# EAGLE design LM1117-adj_power_supply (EAGLE 7.7.0)
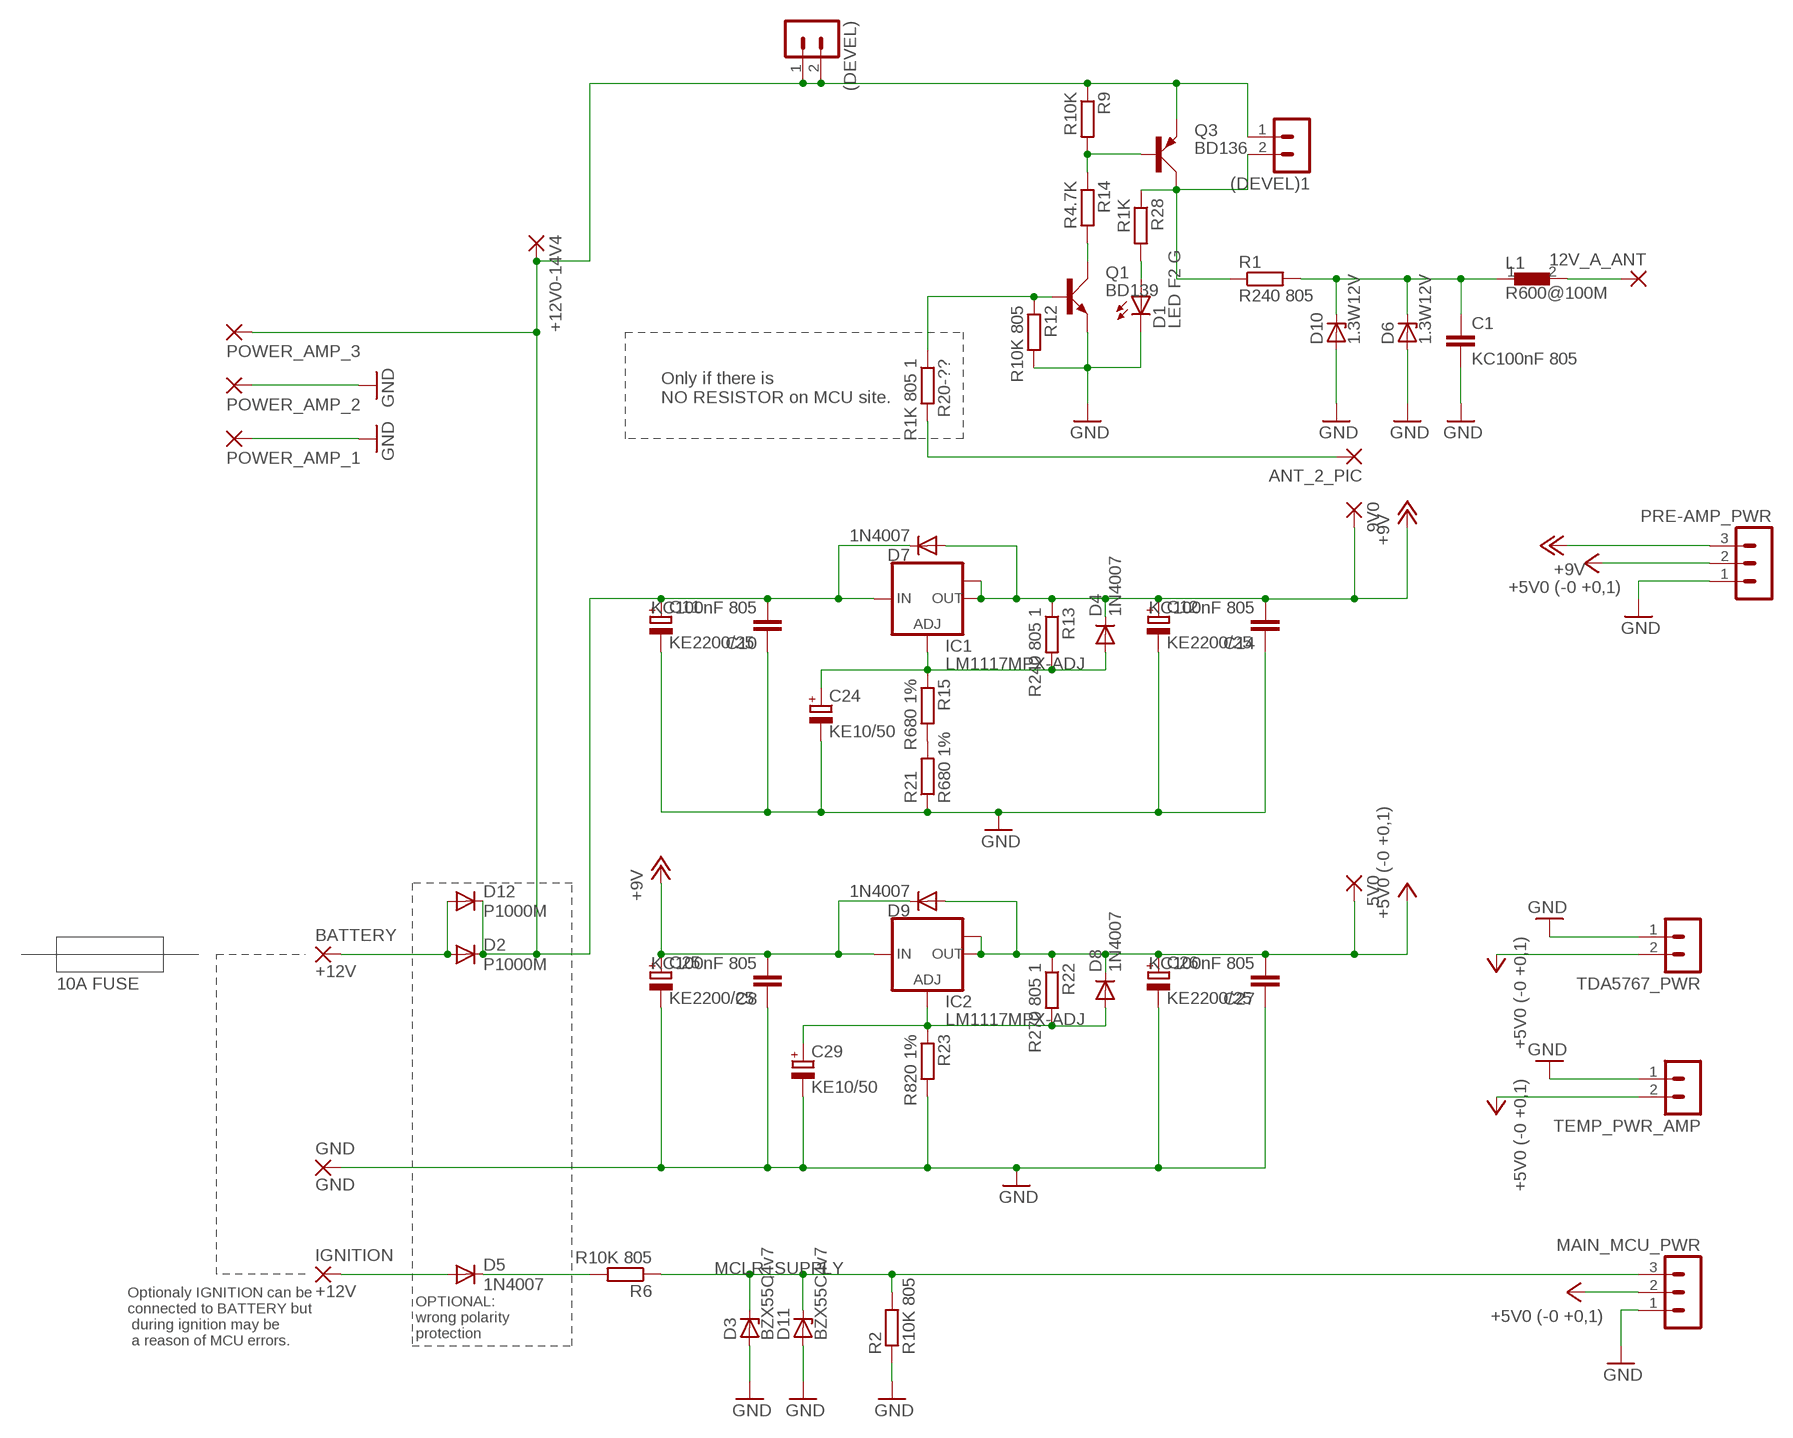
[diagram p0: schematic, sheet 1]

## Parts
5V0  3,17/1,3  [3,17/1,3]
9V0  3,17/1,3  [3,17/1,3]
12V_A_ANT  3,17/1,3  [3,17/1,3]
(DEVEL)  MA02-1  [MA02-1]
(DEVEL)1  MA02-1  [MA02-1]
+12V0-14V4  3,17/1,3  [3,17/1,3]
ANT_2_PIC  1,6/0,8  [1,6/0,8]
BATTERY  +12V  3,81/1,3  [3,81/1,3]
C1  KC100nF 805  C-EUC0805  [C0805]
C8  KC100nF 805  C-EUC0805  [C0805]
C10  KC100nF 805  C-EUC0805  [C0805]
C11  KE2200/25  CPOL-EUE5-13  [E5-13]
C12  KE2200/25  CPOL-EUE5-13  [E5-13]
C14  KC100nF 805  C-EUC0805  [C0805]
C24  KE10/50  CPOL-EUTT2D4  [TT2D4]
C25  KE2200/25  CPOL-EUE5-13  [E5-13]
C26  KE2200/25  CPOL-EUE5-13  [E5-13]
C27  KC100nF 805  C-EUC0805  [C0805]
C29  KE10/50  CPOL-EUTT2D4  [TT2D4]
D1  LED F2 G  SFH482  [SFH482]
D2  P1000M  GI820  [P6-15]
D3  BZX55C4v7  ZENER-DIODEZD-2.5  [ZDIO-2.5]
D4  1N4007  DIODE-D-2.5  [D-2.5]
D5  1N4007  DIODE-D-5  [D-5]
D6  1.3W12V  ZENER-DIODEZD-2.5  [ZDIO-2.5]
D7  1N4007  DIODE-D-5  [D-5]
D8  1N4007  DIODE-D-2.5  [D-2.5]
D9  1N4007  DIODE-D-5  [D-5]
D10  1.3W12V  ZENER-DIODEZD-2.5  [ZDIO-2.5]
D11  BZX55C4v7  ZENER-DIODEZD-2.5  [ZDIO-2.5]
D12  P1000M  GI820  [P6-15]
GND  GND  3,81/1,3  [3,81/1,3]
IC1  LM1117MPX-ADJ  [SOT223]
IC2  LM1117MPX-ADJ  [SOT223]
IGNITION  +12V  3,81/1,3  [3,81/1,3]
L1  R600@100M  FERRITR0805  [R0805]
MAIN_MCU_PWR  MA03-1  [MA03-1]
POWER_AMP_1  3,17/1,3  [3,17/1,3]
POWER_AMP_2  3,17/1,3  [3,17/1,3]
POWER_AMP_3  3,17/1,3  [3,17/1,3]
PRE-AMP_PWR  MA03-1  [MA03-1]
Q1  BD139  [TO126AV]
Q3  BD136  BD140  [TO126AV]
R1  R240 805  R-EU_M0805  [M0805]
R2  R10K 805  R-EU_R0805  [R0805]
R6  R10K 805  R-EU_R0805  [R0805]
R9  R10K  R-EU_0204/5  [0204/5]
R12  R10K 805  R-EU_R0805  [R0805]
R13  R240 805 1  R-EU_M0805  [M0805]
R14  R4.7K  R-EU_0204/5  [0204/5]
R15  R680 1%  R-EU_0204/2V  [0204V]
R20-??  R1K 805 1  R-EU_0204/2V  [0204V]
R21  R680 1%  R-EU_0204/2V  [0204V]
R22  R270 805 1  R-EU_M0805  [M0805]
R23  R820 1%  R-EU_0204/2V  [0204V]
R28  R1K  R-EU_0204/5  [0204/5]
TDA5767_PWR  MA02-1  [MA02-1]
TEMP_PWR_AMP  MA02-1  [MA02-1]

## Nets
+5V: 5V0.1(P) C26.+ C27.2 D8.C D9.A IC2.2(OUT) IC2.TAB(OUT1) MAIN_MCU_PWR.2 PRE-AMP_PWR.2 R22.1 TDA5767_PWR.2 TEMP_PWR_AMP.2 ; supply symbol labelled +5V0 (-0 +0,1)
+12V: 9V0.1(P) C8.2 C12.+ C14.2 C25.+ D4.C D7.A D9.C IC1.2(OUT) IC1.TAB(OUT1) IC2.3(IN) PRE-AMP_PWR.3 R13.1 ; supply symbol labelled +9V
+14.4V: (DEVEL)1.1 (DEVEL).1 (DEVEL).2 +12V0-14V4.1(P) C10.2 C11.+ D2.C D7.C D12.C IC1.3(IN) POWER_AMP_3.1(P) Q3.E R9.1
GND: C1.2 C8.1 C10.1 C11.- C12.- C14.1 C24.- C25.- C26.- C27.1 C29.- D1.K(C) D3.A D6.A D10.A D11.A GND.1(P) MAIN_MCU_PWR.1 POWER_AMP_1.1(P) POWER_AMP_2.1(P) PRE-AMP_PWR.1 Q1.E R2.1 R12.2 R21.1 R23.2 TDA5767_PWR.1 TEMP_PWR_AMP.1
MCLR_SUPPLY: D3.C D11.C MAIN_MCU_PWR.3 R2.2 R6.1
N$1: ANT_2_PIC.1(P) R20-??.2
N$2: C24.+ D4.A IC1.1(ADJ) R13.2 R15.1
N$3: R15.2 R21.2
N$6: BATTERY.1(P) D2.A D12.A
N$7: (DEVEL)1.2 Q3.C R1.1 R28.1
N$13: D5.A IGNITION.1(P)
N$14: D5.C R6.2
N$18: Q1.B R12.1 R20-??.1
N$19: Q1.C R14.2
N$25: Q3.B R9.2 R14.1
N$26: C1.1 D6.C D10.C L1.1 R1.2
N$27: C29.+ D8.A IC2.1(ADJ) R22.2 R23.1
N$33: 12V_A_ANT.1(P) L1.2
N$40: D1.A R28.2

## Notes on the sheet
- Only if there is
  NO RESISTOR on MCU site.
- 10A FUSE
- OPTIONAL:
  wrong polarity
  protection
- Optionaly IGNITION can be
  connected to BATTERY but
   during ignition may be
   a reason of MCU errors.

## Library data of the parts
5V0 9V0 12V_A_ANT +12V0-14V4 POWER_AMP_1-POWER_AMP_3 = wirepad:3,17/1,3: THROUGH-HOLE PAD
(DEVEL) (DEVEL)1 TDA5767_PWR TEMP_PWR_AMP = con-lstb_SileliS:MA02-1: PIN HEADER
ANT_2_PIC = wirepad:1,6/0,8: THROUGH-HOLE PAD
BATTERY GND IGNITION = wirepad:3,81/1,3: THROUGH-HOLE PAD
C1 C8 C10 C14 C27 = rcl:C-EU: CAPACITOR, European symbol
C11 C12 C24-C26 C29 = rcl:CPOL-EU: POLARIZED CAPACITOR, European symbol
D1 = led:SFH482: IR LED infrared emitting diode, Infineon
D2 D12 = diode:GI820: DIODE fast-recovery silicon diode, 6 A (Diotec)
D3 D6 D10 D11 = diode:ZENER-DIODE: Z-Diode
D4 D5 D7-D9 = diode:DIODE-: DIODE
IC1 IC2 = lm1117:LM1117MPX-ADJ
L1 = ferrit_bear:FERRIT
MAIN_MCU_PWR PRE-AMP_PWR = con-lstb_SileliS:MA03-1: PIN HEADER; OC_FARNELL: unknown; OC_NEWARK: unknown
Q1 = transistor-power:BD139: NPN TRANSISTOR
Q3 = transistor-power:BD140: PNP TRANSISTOR
R1 R2 R6 R9 R12-R15 R20-?? R21-R23 R28 = rcl:R-EU_: RESISTOR, European symbol

## Board
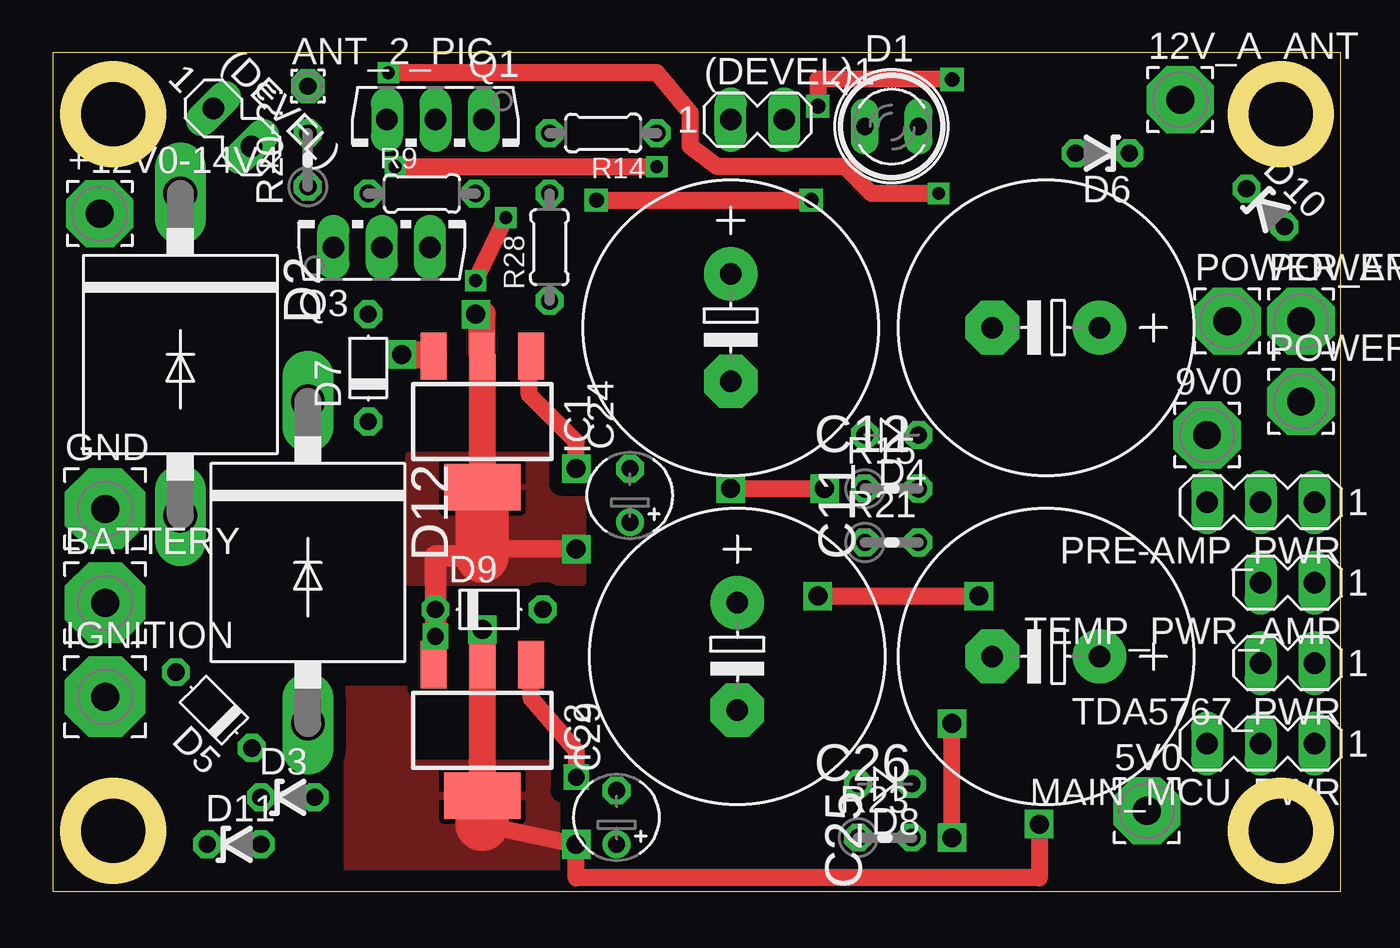
[diagram p1: board, top side]
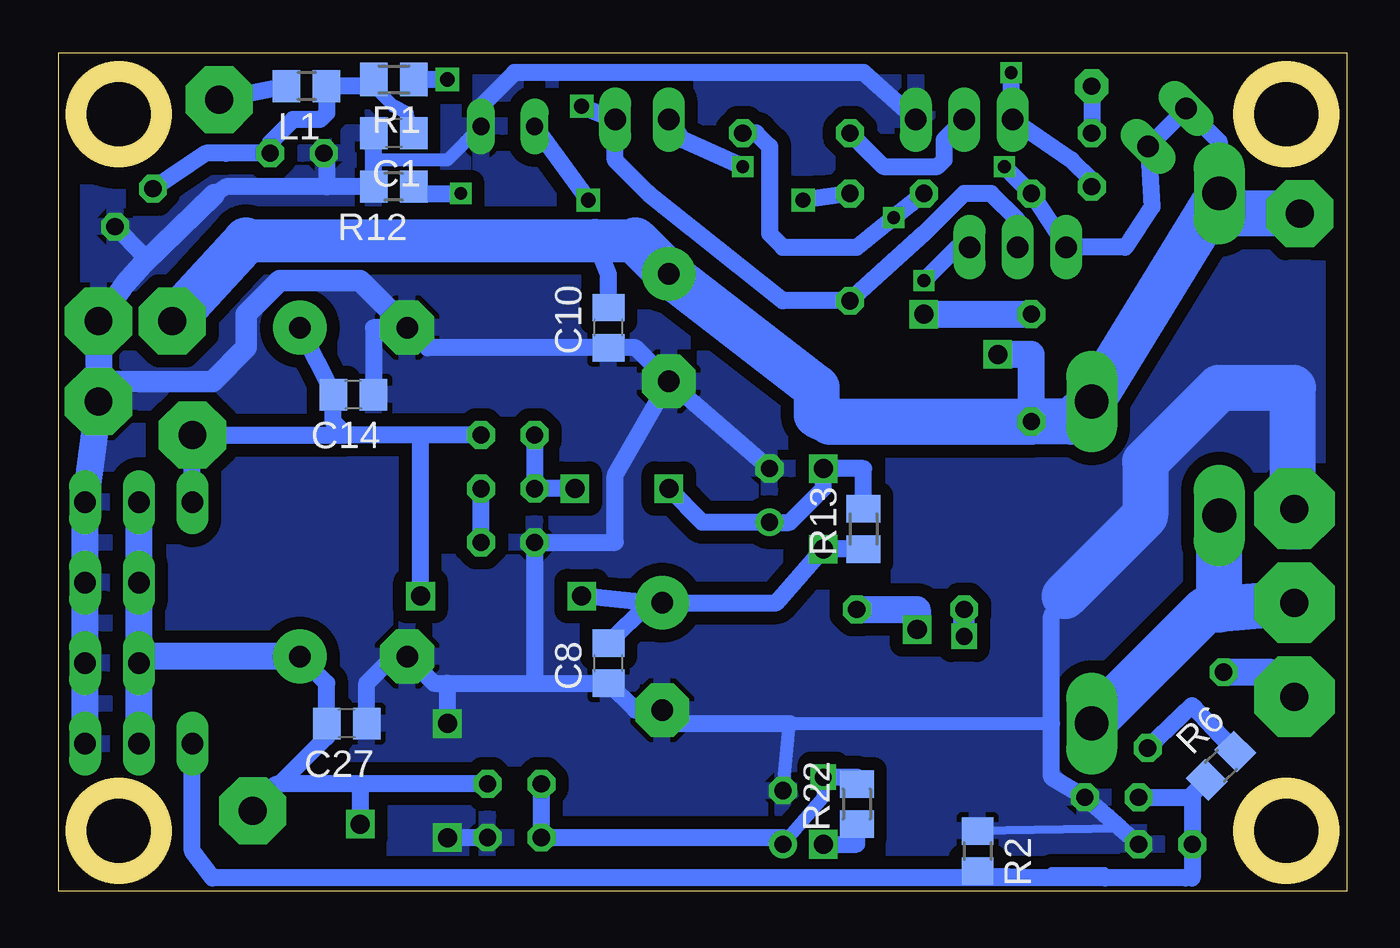
[diagram p2: board, bottom side, seen from below]

Size 60.94 x 39.67 mm. Coordinates in mm from the lower left corner, seen from the top.
Outline: 0,0 60.94,0 60.94,39.67 0,39.67 0,0
Outline: circle at 2.86,36.77 radius 2
Outline: circle at 58.1,2.86 radius 2
Outline: circle at 58.1,36.77 radius 2
Outline: circle at 2.86,2.86 radius 2
Copper layers (1*16): Top 0.035mm / dielectric 1.5mm / Bottom 0.035mm
Design rules "default": minimum track width 10mil, minimum drill 24mil, track to track 8mil, track to pad 8mil, pad to pad 8mil, via to via 8mil, smd to smd 8mil, copper to edge 40mil, drill to drill 8mil, minimum pad ring 10mil, minimum via ring 8mil, stop-mask expansion 4mil, vias tented up to drill 0mil, thermal gap 10mil

### Footprints (pad centres in the part's own frame; a part is rotated, then mirrored left to right if it is on the bottom)
3,17/1,3 = drill 1.321 pad 3.175 octagon: 1 0,0
MA02-1 = drill 1.016 long: 1 -2.54,0; 2 0,0
1,6/0,8 = drill 0.813 pad 1.6 octagon: 1 0,0
3,81/1,3 = drill 1.321 pad 3.81 octagon: 1 0,0
C0805 = smd 1.3 x 1.5: 1 -0.95,0; 2 0.95,0
E5-13 = drill 1.016 pad 2.54: + -2.54,0 | drill 1.016 pad 2.54 octagon: - 2.54,0
TT2D4 = drill 0.813: + -1.27,0 | drill 0.813 octagon: - 1.27,0
SFH482 = drill 0.813 long: A -1.27,0; K 1.27,0
P6-15 = drill 1.6 long: A 7.62,0; C -7.62,0
ZDIO-2.5 = drill 0.813 octagon: A 1.27,0; C -1.27,0
D-2.5 = drill 0.813 octagon: A 1.27,0; C -1.27,0
D-5 = drill 0.813 octagon: A 2.54,0; C -2.54,0
SOT223 = smd 1.219 x 2.235: 1 -2.311,-3.099; 2 0,-3.099; 3 2.311,-3.099 | smd 3.6 x 2.2: TAB 0,3.099
R0805 = smd 1.3 x 1.5: 1 -0.95,0; 2 0.95,0
MA03-1 = drill 1.016 long: 1 -2.54,0; 2 0,0; 3 2.54,0
TO126AV = drill 1.016 long: B 2.286,-1.27; C 0,-1.27; E -2.286,-1.27
M0805 = smd 1.3 x 1.6: 1 -0.95,0; 2 0.95,0
0204/5 = drill 0.813 octagon: 1 -2.54,0; 2 2.54,0
0204V = drill 0.813 octagon: 1 -1.27,0; 2 1.27,0

### Placement (x,y rotation side)
5V0  51.75,3.81 0 top
9V0  54.61,21.59 0 top
12V_A_ANT  53.34,37.47 0 top
(DEVEL)  9.39,35.24 315 top
(DEVEL)1  34.61,36.51 0 top
+12V0-14V4  2.22,32.07 0 top
ANT_2_PIC  12.06,38.1 0 top
BATTERY  2.48,13.65 0 top
C1  45.08,35.88 180 bottom
C8  34.92,10.8 90 bottom
C10  34.92,26.67 90 bottom
C11  32.07,26.67 270 top
C12  46.99,26.67 180 top
C14  46.99,23.5 180 bottom
C24  27.3,18.73 90 top
C25  32.38,11.11 270 top
C26  46.99,11.11 180 top
C27  47.31,7.94 180 bottom
C29  26.67,3.49 90 top
D1  39.69,36.2 0 top
D2  6.03,25.4 270 top
D3  11.11,4.44 0 top
D4  39.69,21.59 180 top
D5  7.62,8.57 135 top
D6  49.66,34.93 180 top
D7  14.92,24.77 90 top
D8  39.37,5.08 180 top
D9  20.64,13.34 0 top
D10  57.37,32.35 315 top
D11  8.57,2.22 0 top
D12  12.06,15.56 270 top
GND  2.48,18.1 0 top
IC1  20.32,22.23 180 top
IC2  20.32,7.62 180 top
IGNITION  2.48,9.21 0 top
L1  49.21,38.1 180 bottom
MAIN_MCU_PWR  57.15,6.99 180 top
POWER_AMP_1  59.06,23.18 0 top
POWER_AMP_2  59.06,26.99 0 top
POWER_AMP_3  55.56,26.99 0 top
PRE-AMP_PWR  57.15,18.41 180 top
Q1  18.1,35.24 180 top
Q3  15.56,31.75 0 top
R1  45.08,38.42 180 bottom
R2  17.46,1.91 270 bottom
R6  5.94,5.94 45 bottom
R9  17.46,33.02 0 top
R12  45.08,33.34 180 bottom
R13  22.86,17.14 90 bottom
R14  26.03,35.88 180 top
R15  39.69,19.05 0 top
R20-??  12.06,34.61 90 top
R21  39.69,16.51 0 top
R22  23.18,4.13 90 bottom
R23  39.37,2.54 0 top
R28  23.49,30.48 90 top
TDA5767_PWR  57.15,10.8 180 top
TEMP_PWR_AMP  57.15,14.61 180 top

### Tracks (layer width: path | path; a pad name or v marks a point on that pad's centre or on a via)
+5V  (via drill 0.9)
  Top 0.813: 20.32,3.17 v24.76,2.22 24.76,0.63 46.67,0.63 v46.67,3.17
  Top 1.27: v20.32,12.38 IC2.2 IC2.TAB
  Top 2.54: IC2.TAB 20.32,3.17
  Bottom 0.813: C26.+ 48.26,9.84 C27.2 48.26,7.3 50.96,4.6 | 50.96,4.6 5V0.1 | 46.67,5.08 50.48,5.08 arc-90 50.96,4.6 | v24.76,2.22 23.18,2.22 R22.1 | D8.C 46.67,5.08 | 46.67,5.08 v46.67,3.17
  Bottom 1.27: D9.A 20.32,13.34 v20.32,12.38 | PRE-AMP_PWR.2 TEMP_PWR_AMP.2 TDA5767_PWR.2 | TDA5767_PWR.2 MAIN_MCU_PWR.2 | C26.+ 56.83,11.11 arc-90 TDA5767_PWR.2
  pour Top (isolate 0.61): 23.81,6.03 23.81,0.63 13.97,0.63 13.97,9.53 16.83,9.53 16.83,6.03
+12V  (via drill 0.8, 0.9)
  Top 0.813: v24.76,16.19 20.64,16.19 20.32,15.88 | v36.19,13.97 v43.81,13.97
  Top 1.016: IC2.3 18.01,12.07 v18.1,12.07 18.1,15.88 20.32,15.88
  Top 1.27: v20,27.3 20.32,27.3 IC1.2 IC1.TAB
  Top 2.54: 20.32,15.88 IC1.TAB
  Bottom 0.813: R13.1 24.44,16.2 v24.76,16.19 26.99,13.65 C25.+ 33.02,13.65 | C8.2 33.02,13.65 | D4.C 43.81,21.59 | 43.81,21.59 47.31,21.59 | 47.31,21.59 47.94,22.23 C14.2 C12.+ | PRE-AMP_PWR.3 9V0.1 47.31,21.59 | 33.02,13.65 v36.19,13.97 | v43.81,13.97 43.81,21.59
  Bottom 1.016: D9.C v18.1,12.07
  Bottom 1.27: v20,27.3 D7.A
  pour Top (isolate 0.61): 16.83,20.64 25.08,20.64 25.08,14.61 16.83,14.61
+14.4V  (via drill 0.6, 0.9)
  Top 0.813: v16.19,34.29 v28.57,34.29
  Top 1.27: v16.51,25.4 17.93,25.4 arc-90 IC1.3
  Bottom 0.813: D2.C 6.03,35.47 (DEVEL).1 (DEVEL).2 9.21,32.38 10.48,30.48 Q3.E R9.1 v16.19,34.29 | C10.2 34.92,29.21 35.56,30.8 | v28.57,34.29 31.43,35.56 (DEVEL)1.1
  Bottom 1.27: D7.C 14.92,25.4 v16.51,25.4
  Bottom 2.032: 52.07,30.8 35.56,30.8 33.65,30.8
  Bottom 2.184: +12V0-14V4.1 6.03,32.07 D2.C D12.C 13.02,22.23 D7.C 24.45,22.23 25.08,22.54 25.08,23.81 31.67,28.9 C11.+ 33.65,30.8 | POWER_AMP_3.1 52.07,30.8
GND  (via drill 0.9)
  Top 0.813: v42.54,2.54 v42.54,7.94
  Bottom 0.406: R2.1 10.7,2.97
  Bottom 0.61: C29.- 26.35,7.94 13.97,7.94 | D1.K 42.54,34.61 46.03,34.61
  Bottom 0.813: 13.33,13.97 13.97,13.02 13.97,7.94 13.97,5.4 D3.A 10.7,2.97 D11.A | 26.35,7.94 31.75,7.94 C25.- 33.65,8.57 C8.1 38.42,9.84 | C24.- C11.- | C11.- 33.66,25.72 C10.1 43.5,25.72 C12.- 46.04,26.67 C14.1 | C27.1 46.36,9.84 45.08,11.11 C26.- 43.18,9.84 42.54,9.84 | 42.54,9.84 38.42,9.84 | 38.42,9.84 R21.1 34.61,16.51 34.61,19.69 C11.- | C1.2 46.03,34.61 R12.2 48.26,33.34 | 48.26,33.34 53.02,33.34 53.59,32.95 | Q1.E 22.86,38.73 39.37,38.73 40.96,37.15 D1.K | R23.2 v42.54,2.54 | v42.54,7.94 42.54,9.84 | D6.A 48.26,34.79 48.26,33.34 | D10.A 56.95,30.13 56.95,29.67
  Bottom 1.016: C12.- 46.67,28.89 50.48,28.89 52.07,27.3 52.07,25.72 53.66,24.13 59.06,24.13 | 53.59,32.95 56.95,29.67 57.78,28.76 POWER_AMP_2.1
  Bottom 1.27: POWER_AMP_2.1 59.06,24.13 POWER_AMP_1.1 PRE-AMP_PWR.1 TEMP_PWR_AMP.1 TDA5767_PWR.1 MAIN_MCU_PWR.1
  Bottom 2.184: GND.1 2.54,18.16 2.54,23.81 6.03,23.81 9.52,20.32 9.52,17.78 13.33,13.97
  pour Bottom (isolate 0.61): -1.27,40.01 62.23,40.01 62.23,-0.64 -2.22,-1.27
MCLR_SUPPLY
  Bottom 0.406: 13.97,0.96 11.43,0.96 11.43,0.63 | R2.2 7.62,0.63
  Bottom 0.813: MAIN_MCU_PWR.3 54.61,1.91 53.66,0.63 11.43,0.63 7.62,0.63 7.3,0.63 D11.C 7.3,4.44 | R6.1 7.3,4.58 7.3,4.44 | D3.C 7.3,4.44
N$1
  Bottom 0.813: ANT_2_PIC.1 R20-??.2
N$2  (via drill 0.9)
  Top 0.813: v24.76,20 24.76,21.27 22.54,23.5 22.54,25.24 IC1.1 | v32.07,19.05 v36.51,19.05
  Bottom 0.813: R13.2 22.86,20 v24.76,20 24.76,19.05 26.35,17.46 C24.+ 30.48,17.46 v32.07,19.05 | D4.A R15.1 v36.51,19.05
N$3
  Bottom 0.813: R21.2 R15.2
N$6
  Bottom 2.184: D2.A 6.03,13.34 BATTERY.1 6.67,13.34 D12.A
N$7  (via drill 0.7)
  Top 0.813: v42.54,38.42 36.19,38.42 v36.19,37.15
  Bottom 0.813: Q3.C 15.56,31.75 16.83,33.02 18.1,33.02 20,31.12 R28.1 26.67,27.94 33.02,33.02 34.61,34.61 (DEVEL)1.2 v36.19,37.15 | R1.1 v42.54,38.42
N$13
  Bottom 1.27: IGNITION.1 3.64,10.37 D5.A
N$14
  Bottom 0.813: D5.C 7.3,8.79 R6.2
N$18  (via drill 0.6)
  Top 0.813: v41.91,33.02 38.73,33.02 37.46,34.29 31.43,34.29 30.16,35.24 30.16,36.83 28.57,38.73 v15.88,38.73
  Bottom 0.813: R20-??.1 12.06,33.66 13.02,34.61 Q1.B 15.88,36.58 v15.88,38.73 | R12.1 43.82,33.02 v41.91,33.02
N$19
  Bottom 0.813: Q1.C 19.05,35.56 19.05,34.61 19.37,34.29 21.91,34.29 R14.2
N$25  (via drill 0.6)
  Top 0.813: v20,28.89 v21.43,31.87
  Bottom 0.813: R14.1 27.94,35.88 27.3,35.24 27.3,31.12 26.67,30.48 23.18,30.48 v21.43,31.87 R9.2 | Q3.B 18.41,30.48 v20,28.89
N$26
  Bottom 0.61: C1.1 44.45,36.83 45.08,37.15 46.03,38.1
  Bottom 0.813: 46.03,38.1 R1.2 46.35,38.1 L1.1 48.26,36.83 48.58,36.51 49.85,36.51 50.93,35.43 D6.C 53.02,34.92 53.97,34.92 D10.C
N$27  (via drill 0.8)
  Top 0.813: IC2.1 22.63,9.12 24.76,6.67 v24.76,5.4
  Bottom 0.61: C29.+ 24.76,4.44 v24.76,5.4
  Bottom 0.813: R22.2 23.18,5.4 v24.76,5.4 | D8.A R23.1 26.67,2.54 C29.+
N$33
  Bottom 0.813: L1.2 12V_A_ANT.1
N$40  (via drill 0.7)
  Top 0.813: v25.72,32.7 v35.88,32.7
  Bottom 0.813: R28.2 v25.72,32.7 | v35.88,32.7 D1.A